# EasyEDA schematic SCH_Cover-FlatField_2025-01-09.json

## Sheets
1 Outputs copy copy: TITLE: Sheet_2; REV: 1.0; Date: 2021-04-28; Sheet: 1/1; Drawn By: hrast; Company: Your Company
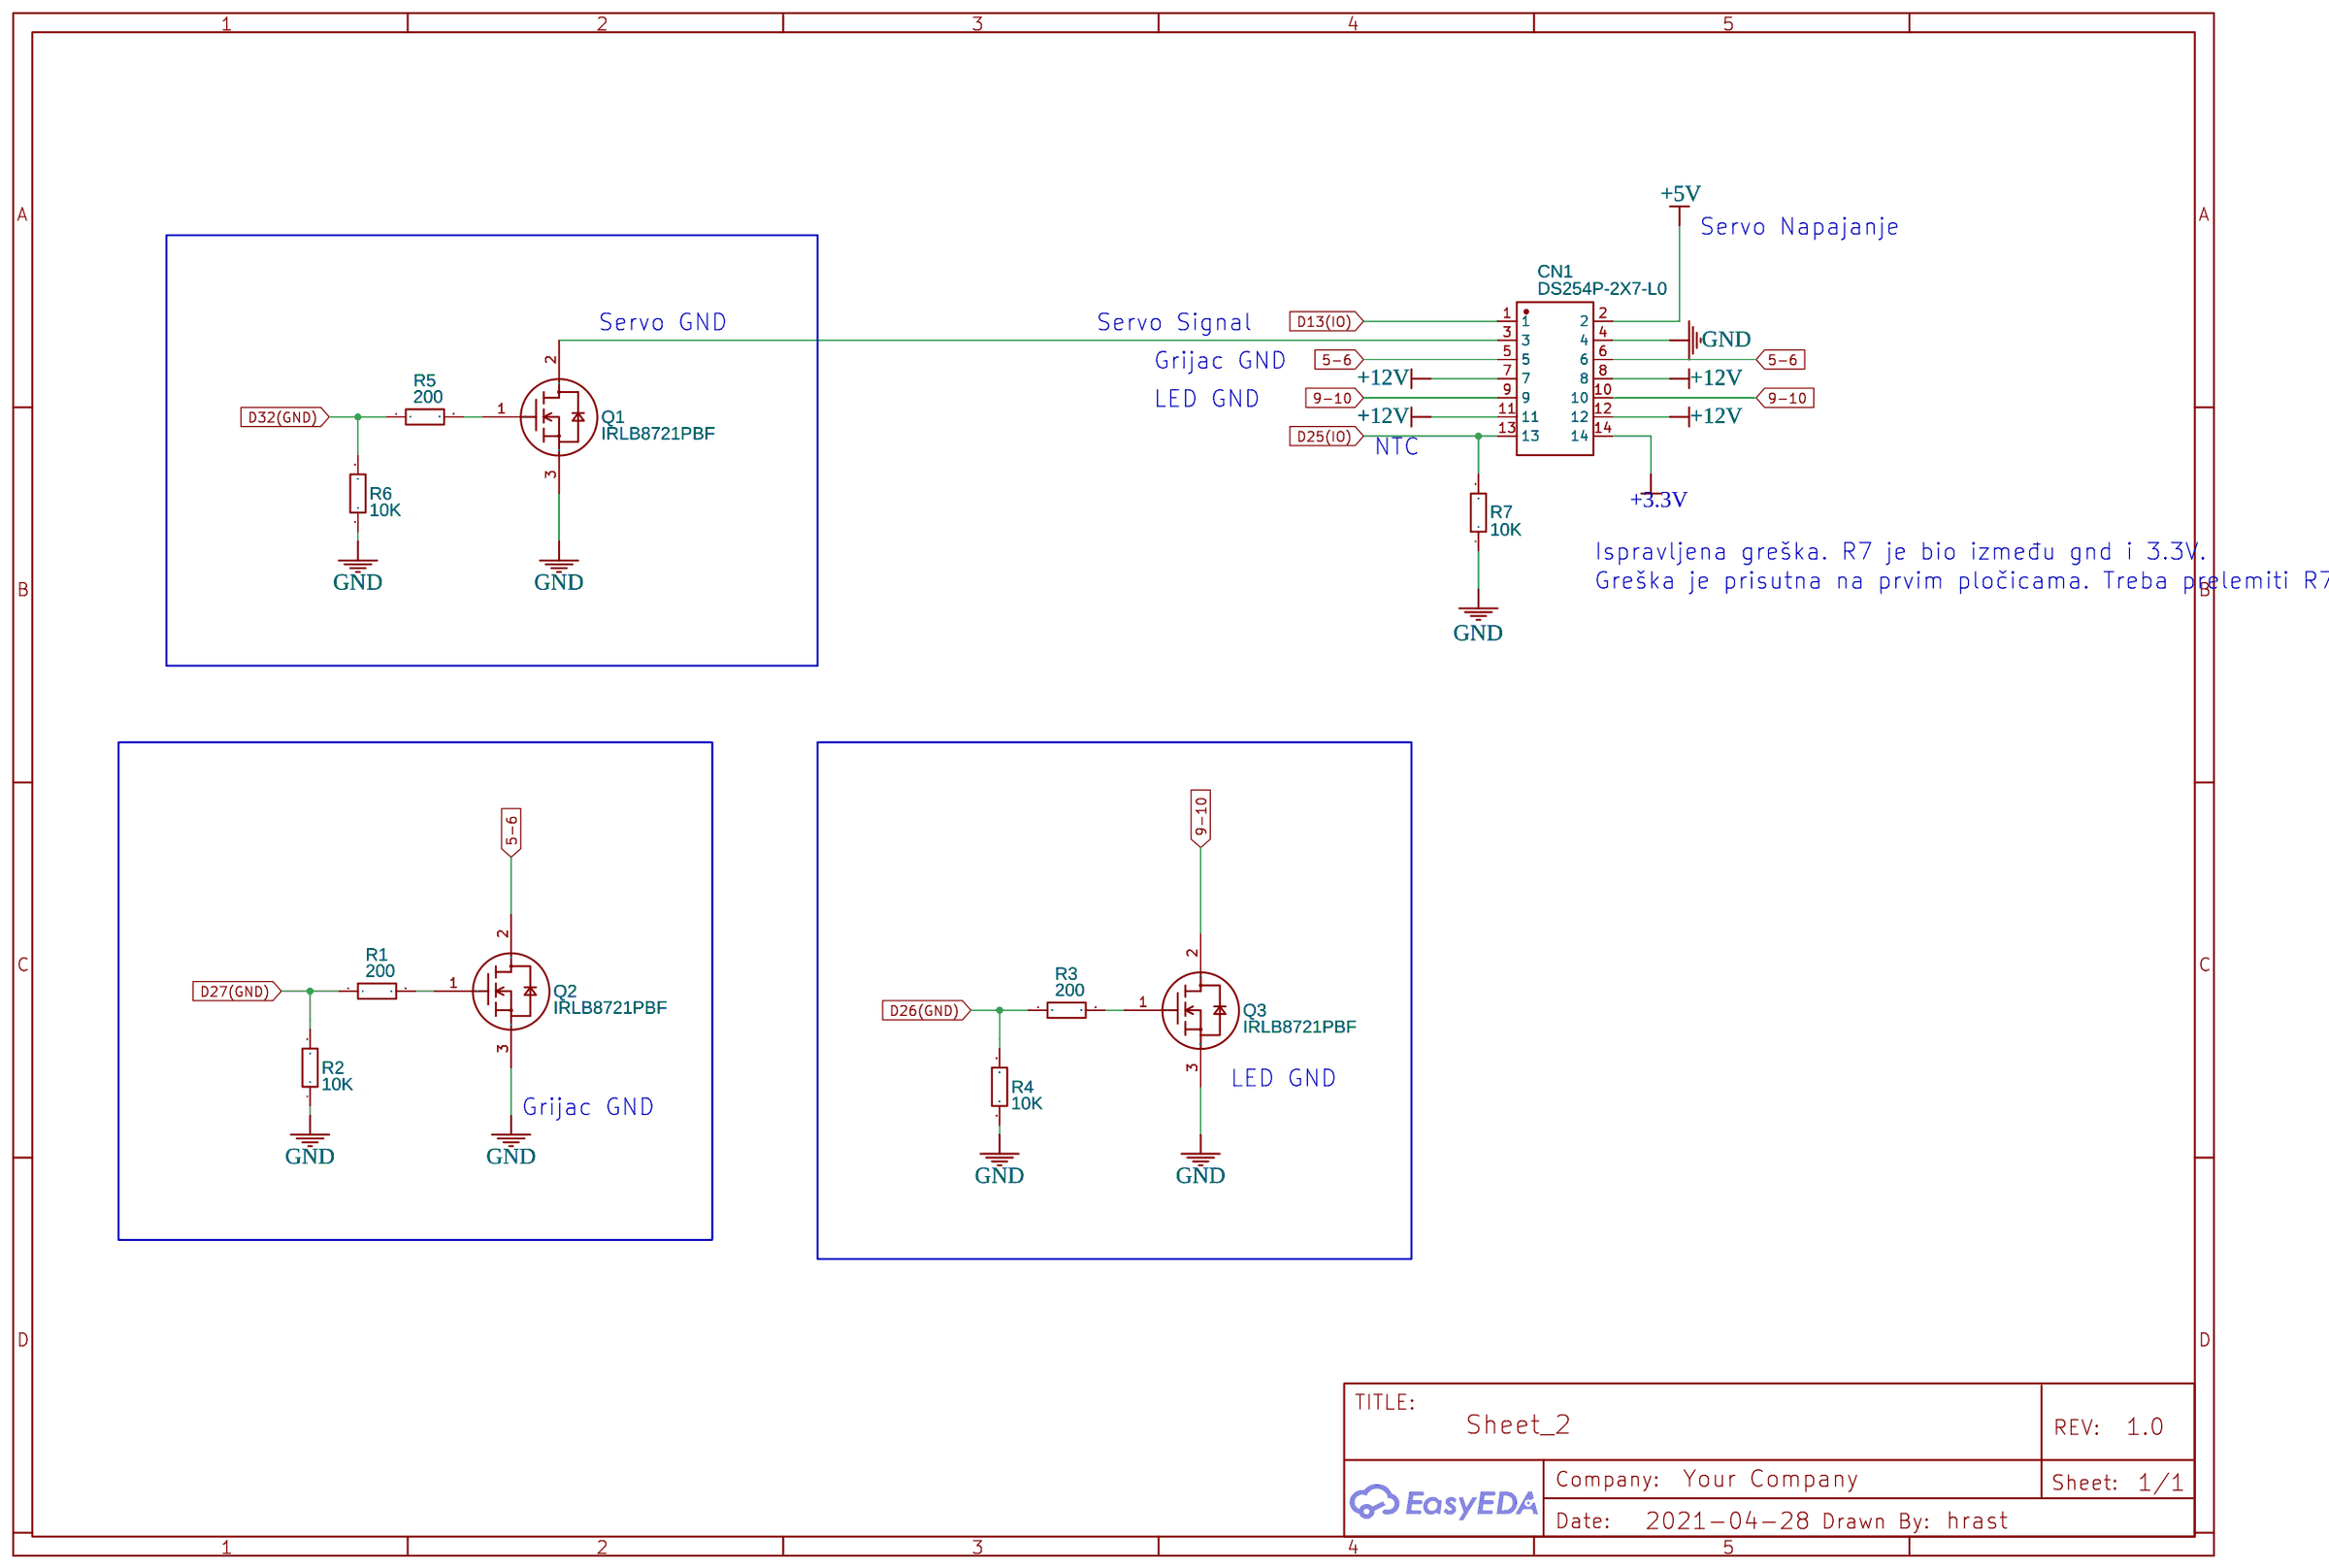
[diagram p0: Outputs copy copy]
2 Main copy copy: TITLE: Sheet_1; Date: 2021-04-27
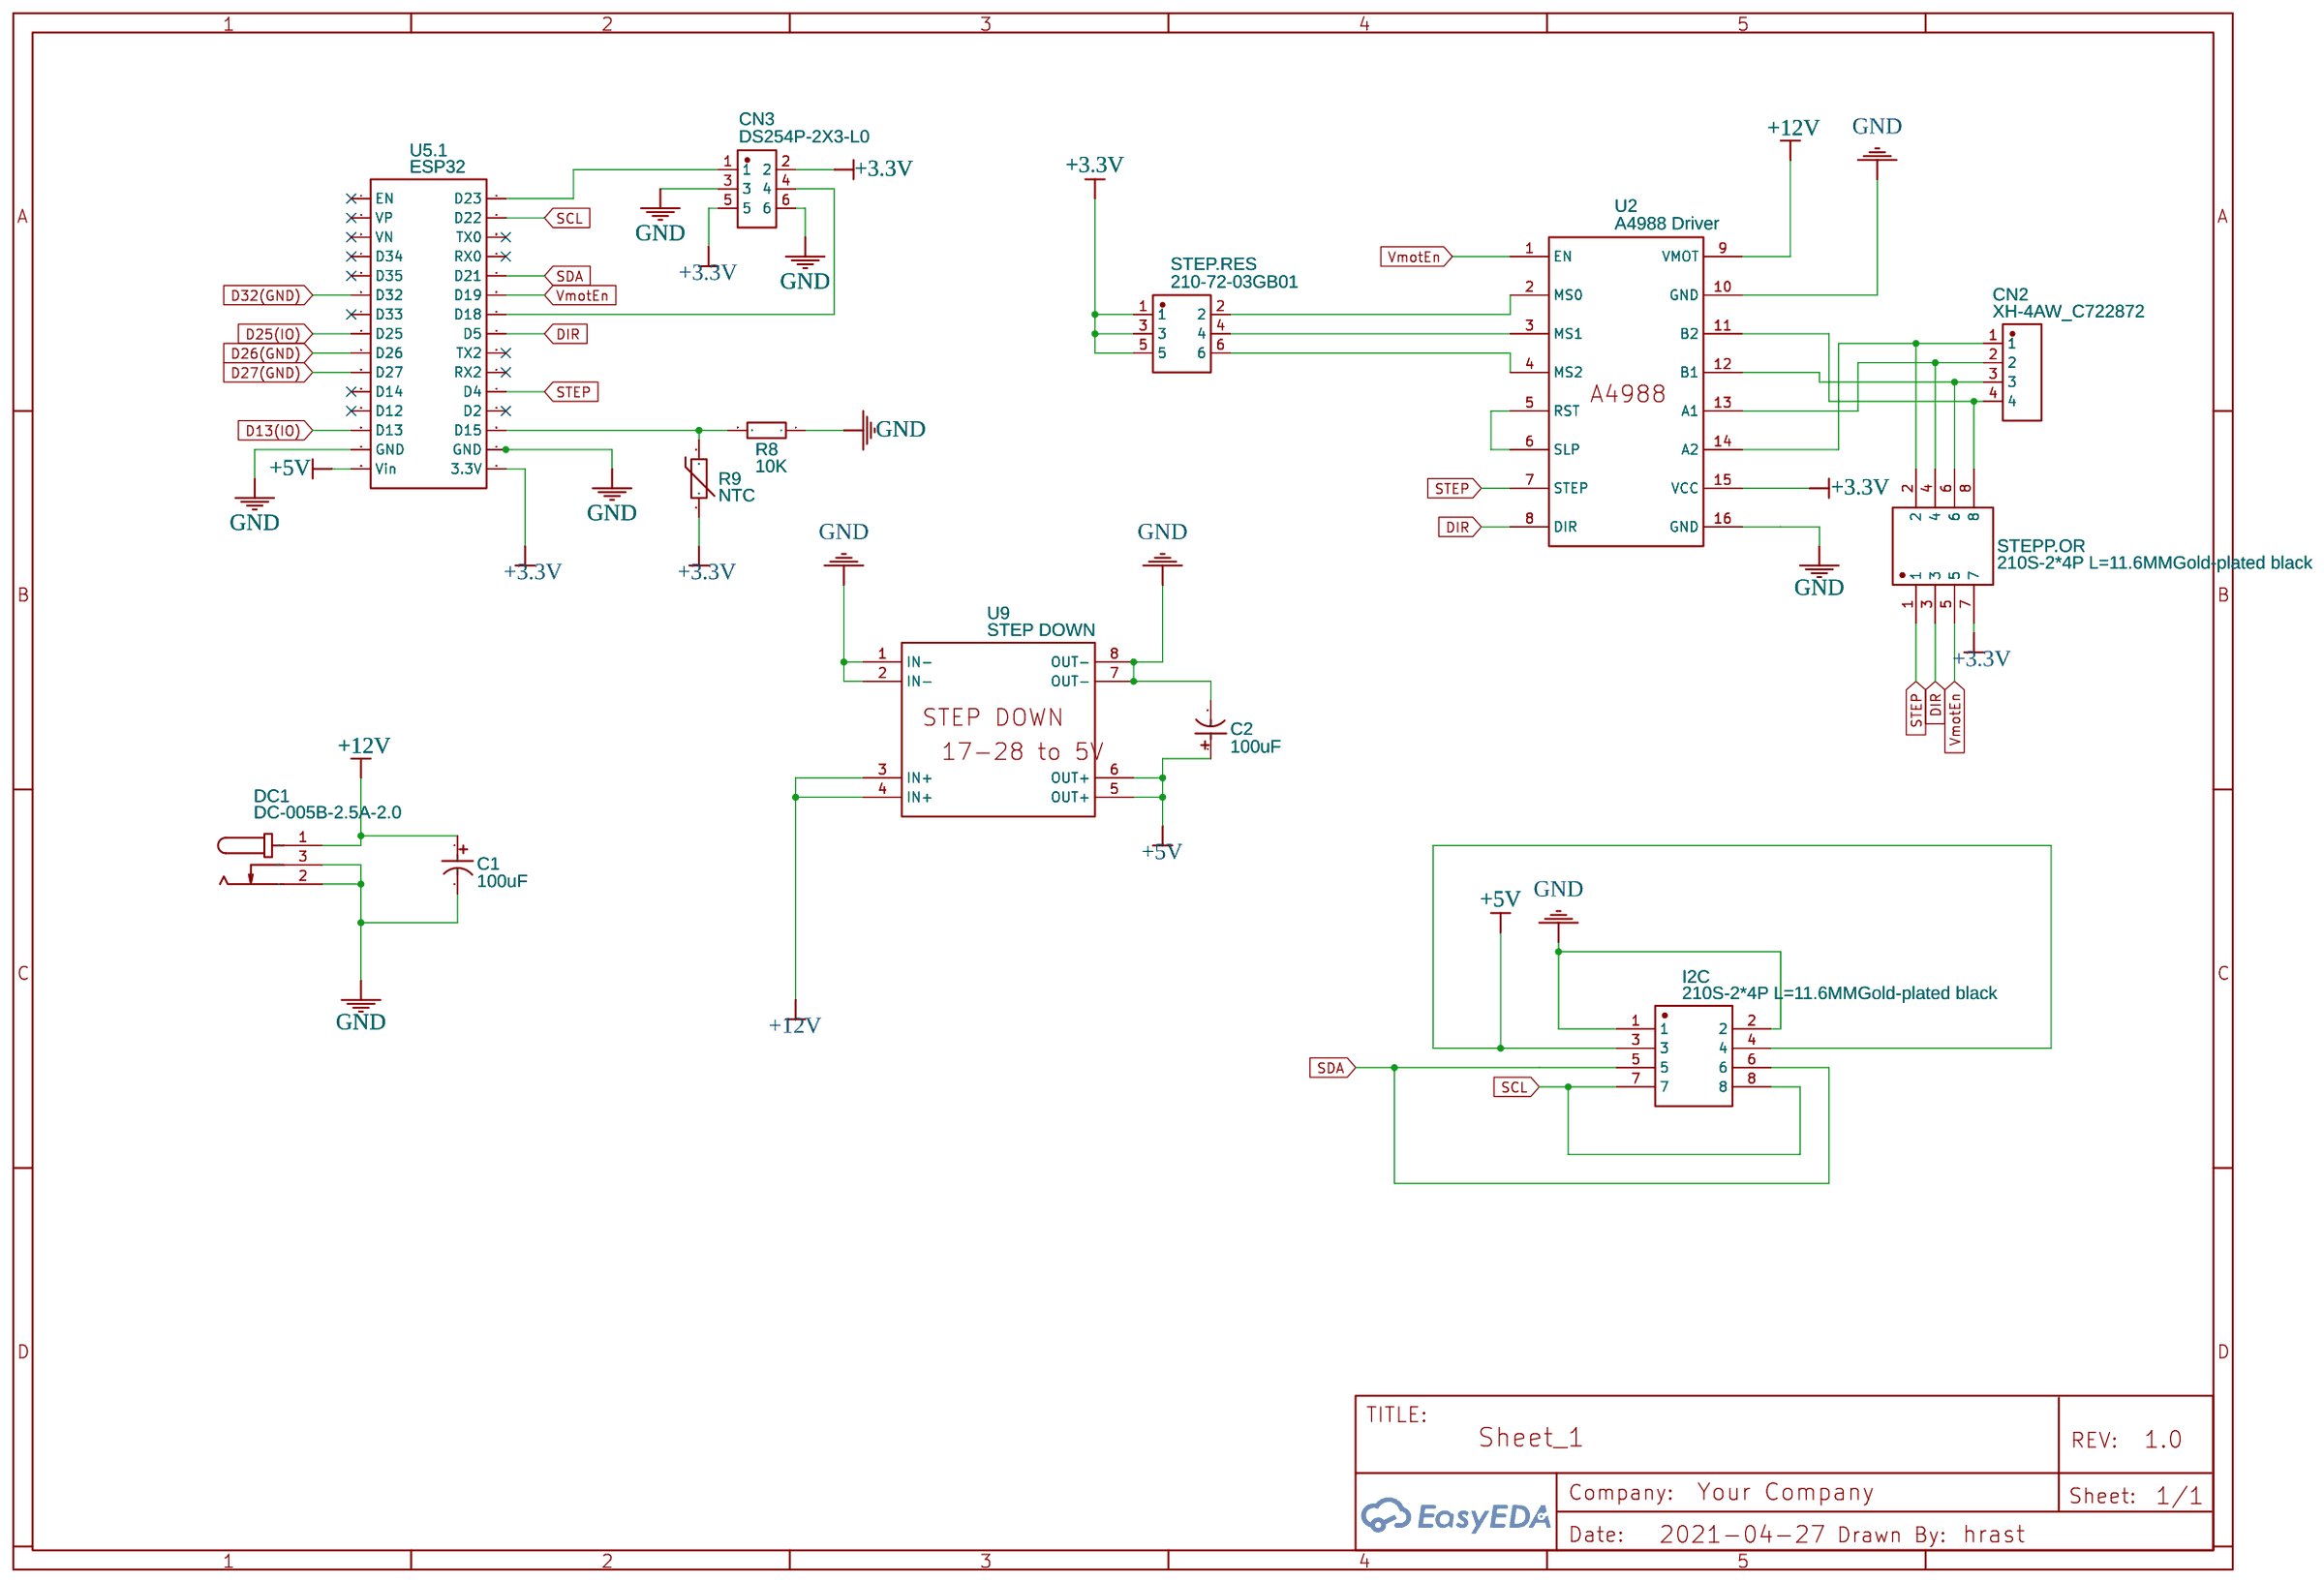
[diagram p1: Main copy copy]

## Parts
sheet Main copy copy
C1  100uF  [CAP-TH_BD5.0-P2.00-D0.8-FD]
C2  100uF  [CAP-TH_BD5.0-P2.00-D0.8-FD]
CN2  XH-4AW_C722872  [CONN-TH_XH-4AW_C722872]
CN3  DS254P-2X3-L0  [IDC-TH_6P-P2.54-V-R2-C3-S2.54]
DC1  DC-005B-2.5A-2.0  [DC-IN-TH_DC-005-20A]
I2C  210S-2*4P L=11.6MMGold-plated black  [HDR-TH_8P-P2.54-V-M-R2-C4-S2.54]
R8  10K  [R1206]
R9  NTC  [RES-TH_L10.5-W5.5-P7.50-D0.6-S5.50]
STEP.RES  210-72-03GB01  [HDR-TH_6P-P2.54-V-R2-C3-S2.54_A2541WV-2X3P]
STEPP.OR  210S-2*4P L=11.6MMGold-plated black  [HDR-TH_8P-P2.54-V-M-R2-C4-S2.54]
U2  A4988 Driver  [DRIVER A4988]
U5  ESP32  [ESP32 DEVELOPMENT KIT]  (section 1)
U9  STEP DOWN  [STEP DOWN]
sheet Outputs copy copy
CN1  DS254P-2X7-L0  [IDC-TH_14P-P2.54-V-R2-C7-S2.54]
Q1  IRLB8721PBF  [TO-220-3_L10.0-W4.5-P2.54-L]
Q2  IRLB8721PBF  [TO-220-3_L10.0-W4.5-P2.54-L]
Q3  IRLB8721PBF  [TO-220-3_L10.0-W4.5-P2.54-L]
R1  200  [R1206]
R2  10K  [R1206]
R3  200  [R1206]
R4  10K  [R1206]
R5  200  [R1206]
R6  10K  [R1206]
R7  10K  [R1206]

## Library data of the parts
C1 C2 = 100uF 25V 5*11: Supplier: LCSC; Manufacturer: ValuePro; Supplier Part: C47873; JLCPCB Part Class: Extended Part
CN2 = XH-4AW_C722872: Supplier: LCSC; Supplier Part: C722872; Manufacturer: CAX; Manufacturer Part: XH-4AW; Contributor: LCSC; JLCPCB Part Class: Extended Part
CN3 = DS254P-2X3-L0: Contributor: lcsc; Supplier: LCSC; Supplier Part: C4749192; Manufacturer: DEALON(德艺隆); JLCPCB Part Class: Extended Part
DC1 = DC-005B-2.5A-2.0: Supplier: LCSC; Supplier Part: C319132; Manufacturer: XKB Enterprise; Contributor: LCSC; JLCPCB Part Class: Extended Part
I2C STEPP.OR = 210S-2*4P L=11.6MMGold-plated black: Supplier: LCSC; Manufacturer: Ckmtw; Contributor: LCSC; Supplier Part: C124386; JLCPCB Part Class: Extended Part
R2 R4 R6-R8 = 1206W4J0103T5E: Supplier: LCSC; Manufacturer: UniOhm; Supplier Part: C1489; JLCPCB Part Class: Extended Part
R9 = NTC 5D-9: Supplier: LCSC; Manufacturer: RUILON(瑞隆源); Manufacturer Part: NTC 5D-9(弯脚); Supplier Part: C3789; JLCPCB Part Class: Extended Part
STEP.RES = 210-72-03GB01: Contributor: LCSC; Supplier: LCSC; Supplier Part: C402781; Manufacturer: PINREX(频锐科技); JLCPCB Part Class: Extended Part
U2 = A4988 Driver: Contributor: 5064871
U5 = ESP32 COPY: Contributor: Vladislav555; subpart_no: 1
U9 = STEP DOWN: Contributor: Flurken
CN1 = DS254P-2X7-L0: Contributor: lcsc; Supplier: LCSC; Supplier Part: C4749196; Manufacturer: DEALON(德艺隆); JLCPCB Part Class: Extended Part
Q1-Q3 = IRLB8721PBF: Supplier: LCSC; Manufacturer: Infineon; Contributor: LCSC; Supplier Part: C153222; LCSC Assembly: Yes; SMT Type: Extend; Paste Type: expand
R1 R3 R5 = RMC12062001%N: Supplier: LCSC; Supplier Part: C325897; Manufacturer: Tyohm; Contributor: LCSC

## Nets
+3.3V: CN1.14 CN3.2 CN3.5 R9.2 STEP.RES.1 STEP.RES.3 STEP.RES.5 STEPP.OR.7 U2.15(VCC) U5.16(3.3V)
+5V: C2.1 CN1.2 I2C.3 I2C.4 U5.15(Vin) U9.5(OUT+) U9.6(OUT+)
+12V: C1.1 CN1.7 CN1.8 CN1.11 CN1.12 DC1.1 U2.9(VMOT) U9.3(IN+) U9.4(IN+)
GND: C1.2 C2.2 CN1.4 CN3.3 CN3.6 DC1.2 DC1.3 I2C.1 I2C.2 Q1.3(S) Q2.3(S) Q3.3(S) R2.1 R4.1 R6.1 R7.1 R8.1 U2.10(GND) U2.16(GND) U5.14(GND) U5.17(GND) U9.1(IN-) U9.2(IN-) U9.7(OUT-) U9.8(OUT-)
5-6: CN1.5 CN1.6 Q2.2(D)
9-10: CN1.9 CN1.10 Q3.2(D)
D13(IO): CN1.1 U5.13(D13)
D25(IO): CN1.13 R7.2 U5.8(D25)
D26(GND): R3.1 R4.2 U5.9(D26)
D27(GND): R1.1 R2.2 U5.10(D27)
D32(GND): R5.1 R6.2 U5.6(D32)
DIR: STEPP.OR.3 U2.8(DIR) U5.23(D5)
SCL: I2C.7 I2C.8 U5.29(D22)
SDA: I2C.5 I2C.6 U5.26(D21)
STEP: STEPP.OR.1 U2.7(STEP) U5.20(D4)
VmotEn: STEPP.OR.5 U2.1(EN) U5.25(D19)
Net-(CN1-3): CN1.3 Q1.2(D)
Net-(CN2-1): CN2.1 STEPP.OR.2 U2.14(A2)
Net-(CN2-2): CN2.2 STEPP.OR.4 U2.13(A1)
Net-(CN2-3): CN2.3 STEPP.OR.6 U2.12(B1)
Net-(CN2-4): CN2.4 STEPP.OR.8 U2.11(B2)
Net-(CN3-1): CN3.1 U5.30(D23)
Net-(CN3-4): CN3.4 U5.24(D18)
Net-(Q1-1): Q1.1(G) R5.2
Net-(Q2-1): Q2.1(G) R1.2
Net-(Q3-1): Q3.1(G) R3.2
Net-(R8-2): R8.2 R9.1 U5.18(D15)
Net-(STEP.RES-2): STEP.RES.2 U2.2(MS0)
Net-(STEP.RES-4): STEP.RES.4 U2.3(MS1)
Net-(STEP.RES-6): STEP.RES.6 U2.4(MS2)
Net-(U2-5): U2.5(RST) U2.6(SLP)

Not connected (* = marked no-connect by the designer): U5 1(EN)* 2(VP)* 3(VN)* 4(D34)* 5(D35)* 7(D33)* 11(D14)* 12(D12)* 19(D2)* 21(RX2)* 22(TX2)* 27(RX0)* 28(TX0)*

## Notes on the sheets
sheet 1
- Servo Napajanje
- Servo GND
- Servo Signal
- Grijac GND
- LED GND
- NTC
- Ispravljena greška. R7 je bio između gnd i 3.3V.
- Greška je prisutna na prvim pločicama. Treba prelemiti R7
- LED GND
- Grijac GND
